# EAGLE design ac-timer-panel (EAGLE 9.6.2)
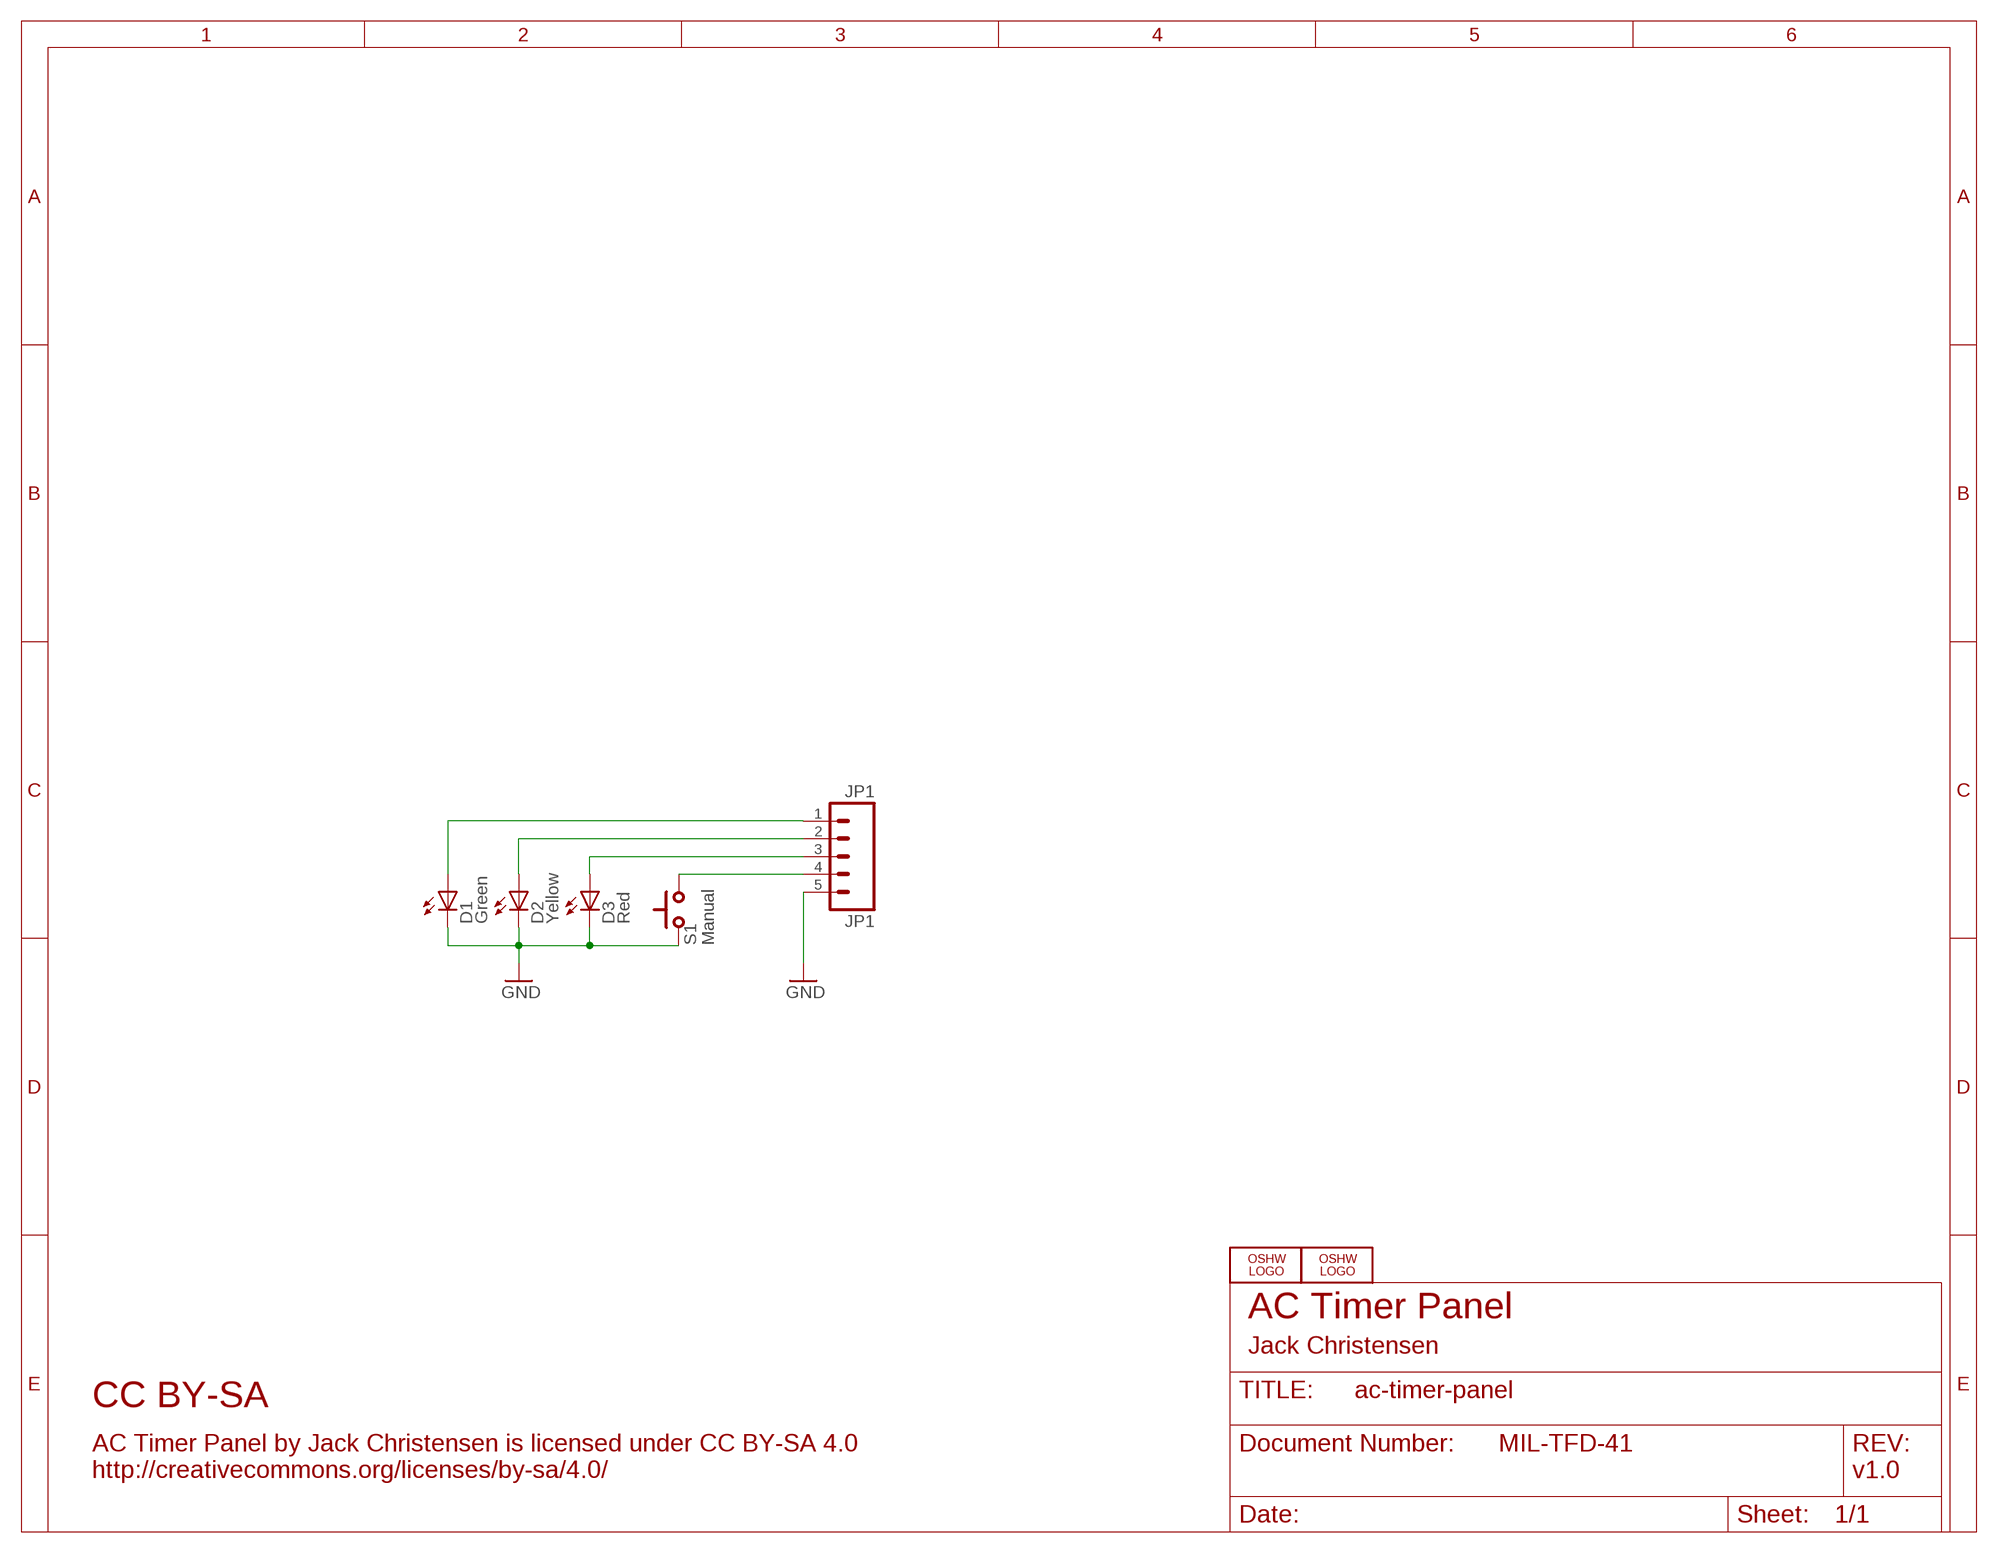
[diagram p0: schematic, sheet 1]

## Parts
D1  Green  LED5MM-LONGPADS  [LED5MM-OVAL]
D2  Yellow  LED5MM-LONGPADS  [LED5MM-OVAL]
D3  Red  LED5MM-LONGPADS  [LED5MM-OVAL]
JP1  JP1  M05LOCK  [1X05_LOCK]
LOGO1  OSHW_LOGO_8MILX0100-NT  [OSHW_8X100_NOTEXT]
LOGO2  OSHW_LOGO_8MILX0100-NT  [OSHW_8X100_NOTEXT]
S1  Manual  SPST-NO-MCPUSHBUTTON  [SPST-NO-MC]

## Nets
GND: D1.K(C) D2.K(C) D3.K(C) JP1.5 S1.P$2
N$1: D3.A JP1.3
N$2: D2.A JP1.2
N$3: D1.A JP1.1
N$4: JP1.4 S1.P$1

## Notes on the sheet
- AC Timer Panel
- Jack Christensen
- CC BY-SA
- MIL-TFD-41
- AC Timer Panel by Jack Christensen is licensed under CC BY-SA 4.0
  http://creativecommons.org/licenses/by-sa/4.0/
- v1.0

## Library data of the parts
D1-D3 = _jc:LED: LED OSRAM: - CHIPLED LG R971, LG N971, LY N971, LG Q971, LY Q971, LO R971, LY R971 LH N974, LH R974 LS Q976, LO Q976, LY Q976 LO Q996 - Hyper CHIPLED LW Q18S LB Q993, LB Q99A, LB R99A - SideLED LS A670, LO A670, LY A670, LG A670, LP A670 LB A673, LV A673, LT A673, LW A673 LH A674 LY A675 LS A676, LA A676, LO A676, LY A676, LW A676 LS A679, LY A679, LG A679 - Hyper Micro SIDELED® LS Y876, LA Y876, LO Y876, LY Y876 LT Y87S - SmartLED LW L88C, LW L88S LB L89C, LB L89S, LG L890 LS L89K, LO L89K, LY L89K LS L896, LA L896, LO L896, LY L896 - TOPLED LS T670, LO T670, LY T670, LG T670, LP T670 LSG T670, LSP T670, LSY T670, LOP T670, LYG T670 LG T671, LOG T671, LSG T671 LB T673, LV T673, LT T673, LW T673 LH T674 LS T676, LA T676, LO T676, LY T676, LB T676, LH T676, LSB T676, LW T676 LB T67C, LV T67C, LT T67C, LS T67K, LO T67K, LY T67K, LW E67C LS E67B, LA E67B, LO E67B, LY E67B, LB E67C, LV E67C, LT E67C LW T67C LS T679, LY T679, LG T679 LS T770, LO T770, LY T770, LG T770, LP T770 LB T773, LV T773, LT T773, LW T773 LH T774 LS E675, LA E675, LY E675, LS T675 LS T776, LA T776, LO T776, LY T776, LB T776 LHGB T686 LT T68C, LB T68C - Hyper Mini TOPLED® LB M676 - Mini TOPLED Santana® LG M470 LS M47K, LO M47K, LY M47K Source: http://www.osram.convergy.de/
JP1 = SparkFun:M05: Header 5 Standard 5-pin 0.1" header. Use with straight break away headers (SKU : PRT-00116), right angle break away headers (PRT-00553), swiss pins (PRT-00743), machine pins (PRT-00117), and female headers (PRT-00115). Molex polarized connector foot print use with SKU : PRT-08230 with associated crimp pins and housings.
LOGO1 LOGO2 = ohw-logo:OSHW_LOGO_8MIL
S1 = _jc:SPST-NO-MC: Momentary contact pushbutton switch, SPST, NO.

## Board
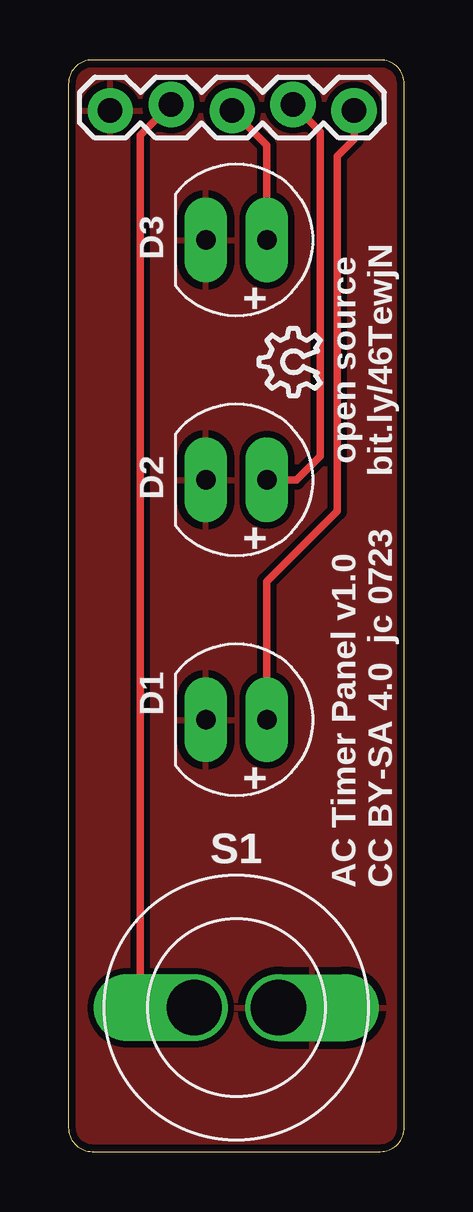
[diagram p1: board, top side]
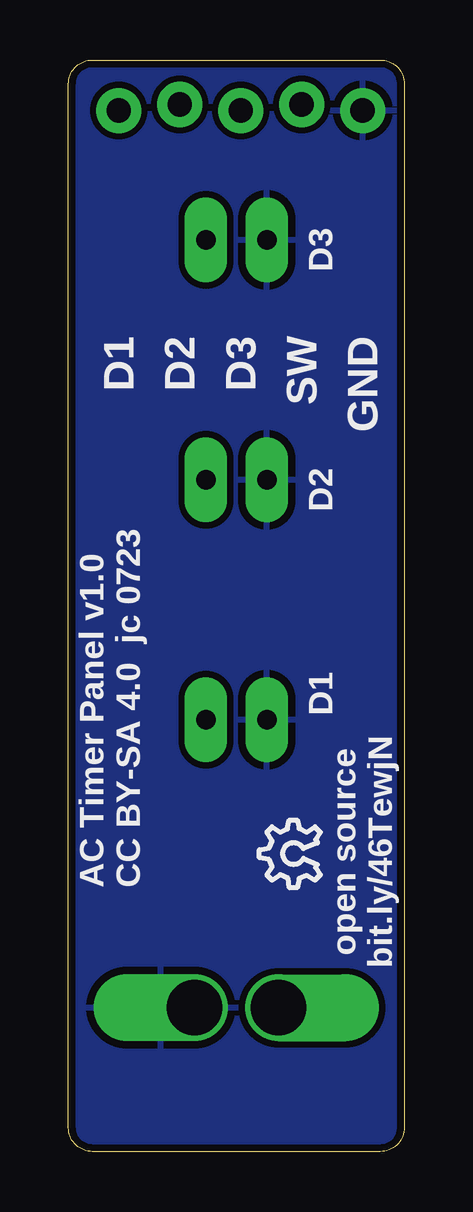
[diagram p2: board, bottom side, seen from below]

Size 14 x 45.5 mm. Coordinates in mm from the lower left corner, seen from the top.
Outline: 0,44.5 0,1 arc90 1,0 13,0 arc90 14,1 14,44.5 arc90 13,45.5 1,45.5 arc90 0,44.5
Copper layers (1*16): Top 0.0356mm / dielectric 1.5011mm / Bottom 0.0356mm
Design rules "oshpark-2layer-jc *": minimum track width 8mil, minimum drill 13mil, track to track 8mil, track to pad 8mil, pad to pad 8mil, via to via 8mil, smd to smd 6mil, copper to edge 12mil, drill to drill 6mil, minimum pad ring 7mil, minimum via ring 7mil, stop-mask expansion 2.5mil, vias tented up to drill 20mil, thermal gap 12mil

### Footprints (pad centres in the part's own frame; a part is rotated, then mirrored left to right if it is on the bottom)
LED5MM-OVAL = drill 0.813 pad 1.778 long: A -1.27,0; K 1.27,0
1X05_LOCK = drill 1.016 pad 1.88: 1 0,0.127; 2 2.54,-0.127; 3 5.08,0.127; 4 7.62,-0.127; 5 10.16,0.127
SPST-NO-MC = drill 2.3 pad 2.8 offset: P$1 1.75,0; P$2 -1.75,0

### Placement (x,y rotation side)
D1  7,18 180 top
D2  7,28 180 top
D3  7,38 180 top
JP1  11.9,43.52 180 top
LOGO1  10.5,31.5 90 top
LOGO2  3.5,11 90 bottom
S1  7,6 180 top

### Tracks (layer width: path | path; a pad name or v marks a point on that pad's centre or on a via)
GND
  pour Bottom (isolate 0.254): -1.5,-1.5 15.5,-1.5 15.5,47 -1.5,47
  pour Top (isolate 0.254): -1,46.5 -1,-1 15,-1 15,46.5
N$1
  Top 0.305: JP1.3 8.27,41.94 D3.A
N$2
  Top 0.305: JP1.2 10.5,42.51 10.5,29 9.5,28 D2.A
N$3
  Top 0.305: D1.A 8.27,23.77 11.2,26.7 11.2,41.5 11.9,42.2 JP1.1
N$4
  Top 0.305: JP1.4 3,42.37 3,7 4,6 S1.P$1

### Text on the board
tPlace: open source / bit.ly/46TewjN | AC Timer Panel v1.0 / CC BY-SA 4.0 jc 0723
bPlace: D3 | GND | SW | D3 | D2 | D1 | D2 | D1 | open source / bit.ly/46TewjN | AC Timer Panel v1.0 / CC BY-SA 4.0 jc 0723